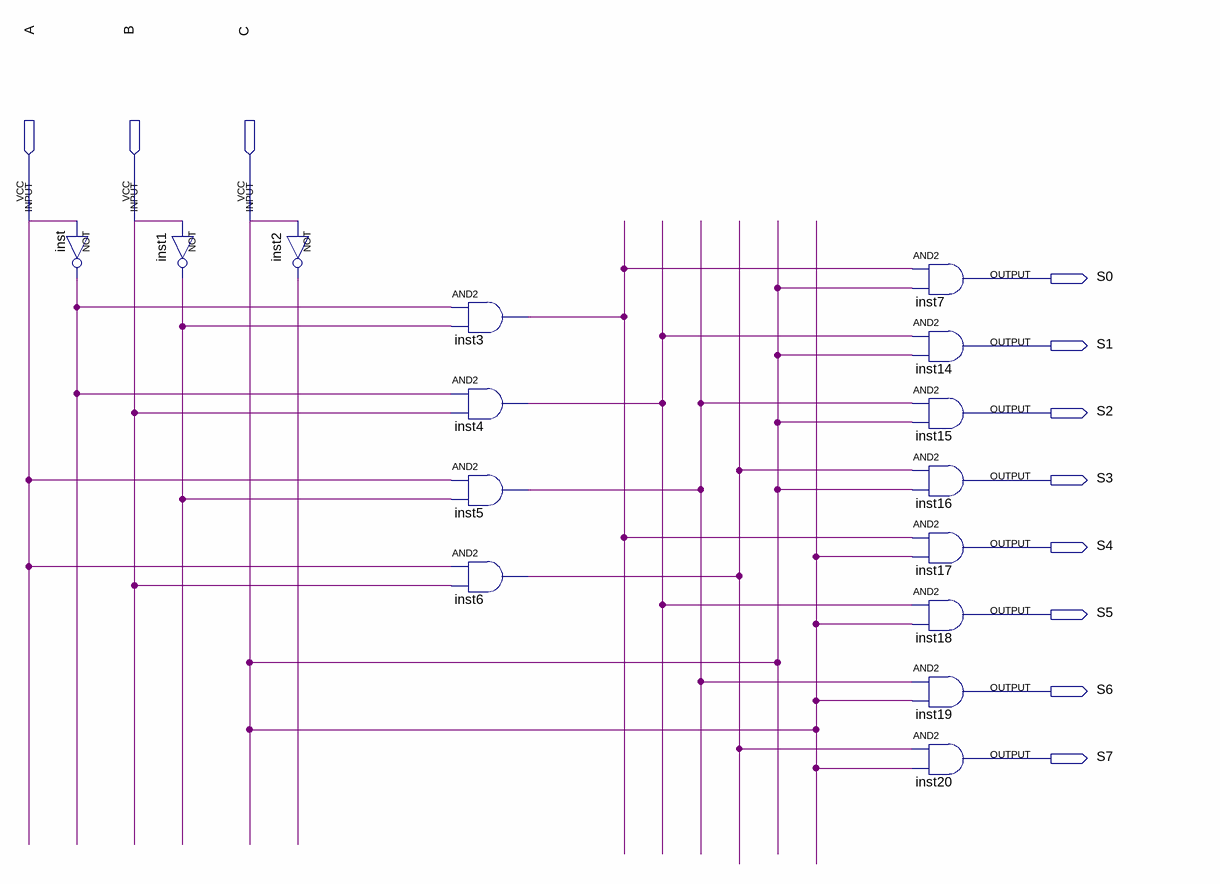
[diagram p0: schematic sheet]
// Quartus schematic DECO3x8.bdf as structural Verilog: 15 symbols, 11 pins
module DECO3x8 (
  input  A,
  input  B,
  input  C,
  output S0,
  output S1,
  output S2,
  output S3,
  output S4,
  output S5,
  output S6,
  output S7
);

  wire inst1_out, inst2_out, inst3_out, inst4_out, inst5_out, inst6_out, inst_out;

  not inst (inst_out, A);
  not inst1 (inst1_out, B);
  not inst2 (inst2_out, C);
  and inst3 (inst3_out, inst_out, inst1_out);
  and inst4 (inst4_out, inst_out, B);
  and inst5 (inst5_out, A, inst1_out);
  and inst6 (inst6_out, A, B);
  and inst7 (S0, inst3_out, C);
  and inst14 (S1, inst4_out, C);
  and inst15 (S2, inst5_out, C);
  and inst16 (S3, inst6_out, C);
  and inst17 (S4, inst3_out, C);
  and inst18 (S5, inst4_out, C);
  and inst19 (S6, inst5_out, C);
  and inst20 (S7, inst6_out, C);
endmodule
